# EasyEDA schematic schematic.json
TITLE: LED Chaser with 555 IC and CD4017; REV: 2.0; Date: 2025-02-25; Sheet: 1/1; Drawn By: Angelina Tsuboi; Company: Angelina Tsuboi and John Cohn
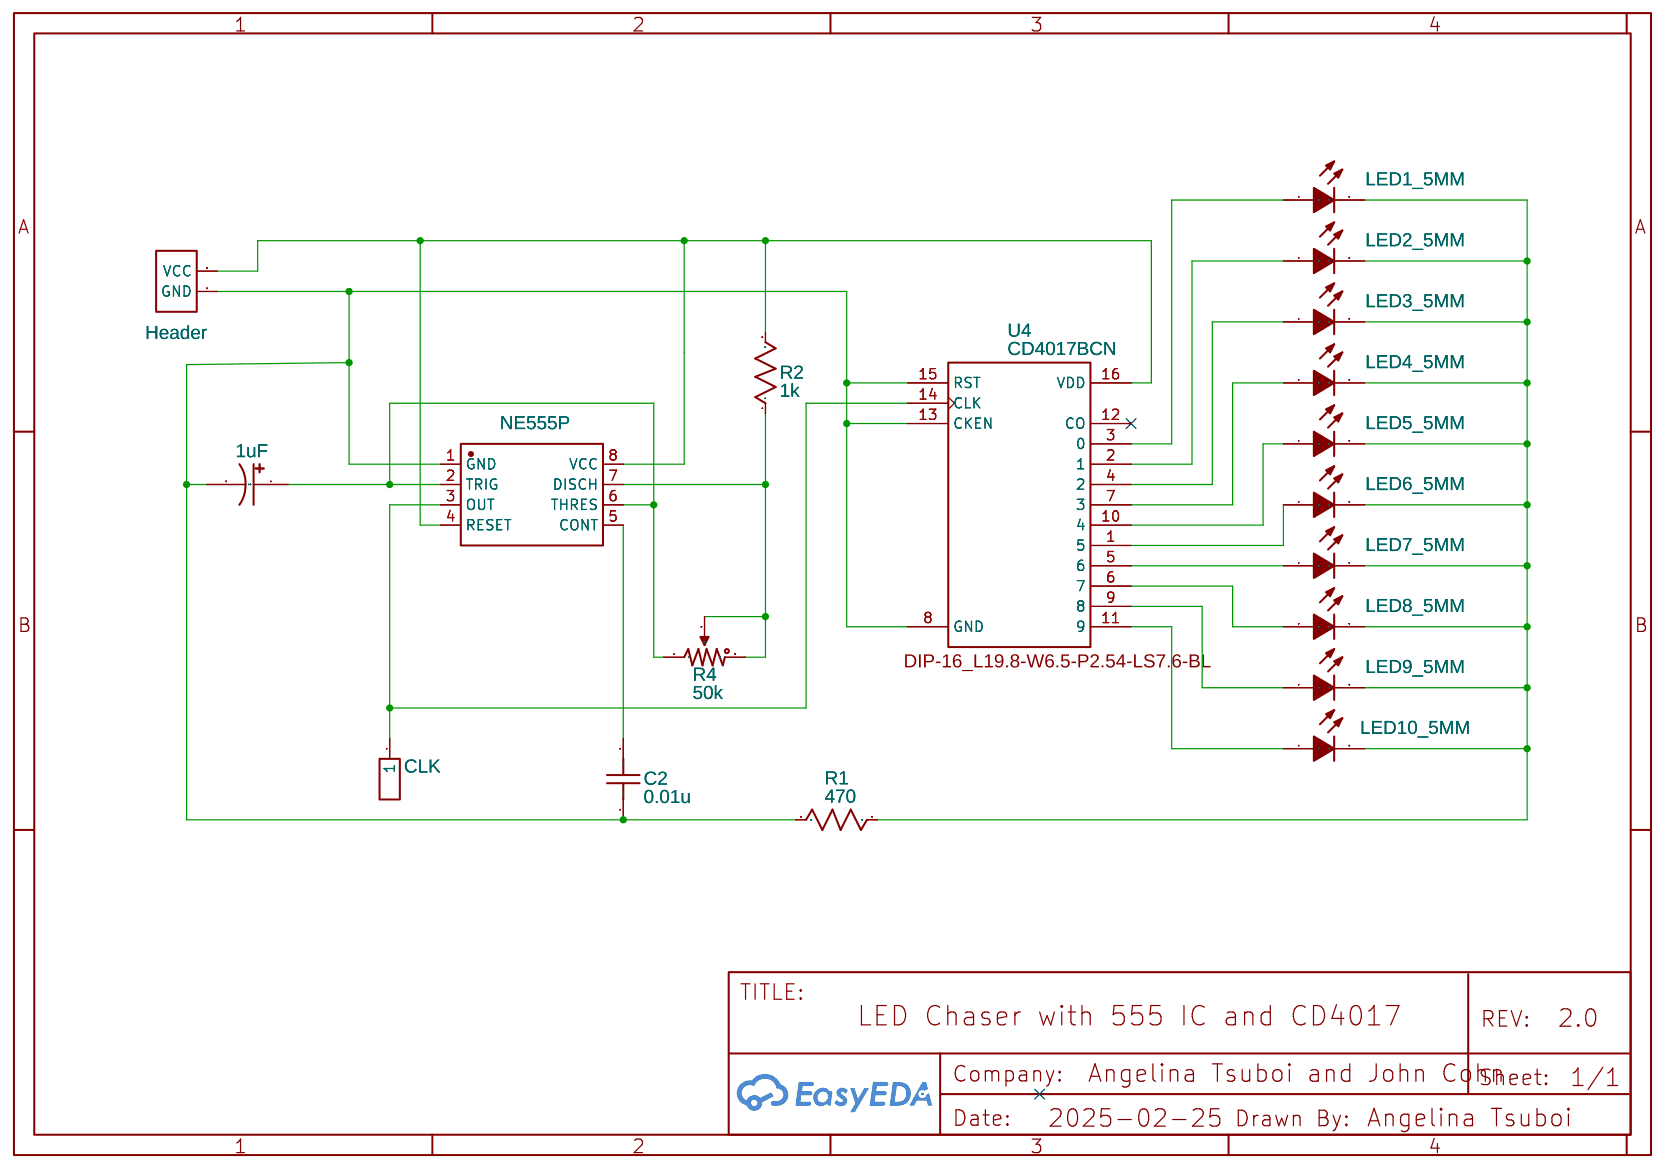
[diagram p0: schematic sheet]

## Parts
C1  1uF  [CAP-TH_BD5.0-P2.00-D0.8-FD]
C2  0.01u  [C0603]
CLK  C81276  [HDR-TH_1P-P2.54-V-M]
H1  Header  [HDR-M-2.54_1X2]
LED1_5MM  LED_5MM  [LED-TH_BD5.0-P2.54-FD_C9900023552]
LED2_5MM  LED_5MM  [LED-TH_BD5.0-P2.54-FD_C9900023552]
LED3_5MM  LED_5MM  [LED-TH_BD5.0-P2.54-FD_C9900023552]
LED4_5MM  LED_5MM  [LED-TH_BD5.0-P2.54-FD_C9900023552]
LED5_5MM  LED_5MM  [LED-TH_BD5.0-P2.54-FD_C9900023552]
LED6_5MM  LED_5MM  [LED-TH_BD5.0-P2.54-FD_C9900023552]
LED7_5MM  LED_5MM  [LED-TH_BD5.0-P2.54-FD_C9900023552]
LED8_5MM  LED_5MM  [LED-TH_BD5.0-P2.54-FD_C9900023552]
LED9_5MM  LED_5MM  [LED-TH_BD5.0-P2.54-FD_C9900023552]
LED10_5MM  LED_5MM  [LED-TH_BD5.0-P2.54-FD_C9900023552]
R1  470  [R_AXIAL-0.3]
R2  1k  [R_AXIAL-0.3]
R4  50k  [RES-ADJ-3296X]
U2  NE555P  [DIP-8_L9.8-W6.6-P2.54-LS7.6-BL]
U4  CD4017BCN  [DIP-16_L19.8-W6.5-P2.54-LS7.6-BL]

## Library data of the parts
C1 = UVZ1H010MDD: Contributor: LCSC; Supplier: LCSC; Supplier Part: C62934; Manufacturer: Nichicon(尼吉康)
C2 = C_0603_US: Supplier Part: C5121924; Supplier: LCSC; Contributor: LCEDA_Lib
CLK = Header-Male-2.54_1x1: Supplier: LCSC; Manufacturer Part: 2.54-1*1P针; JLCPCB Part Class: Extended Part; Package Display: No; Manufacturer: BOOMELE(Boom Precision Elec); Contributor: Thejo Prakash
H1 = HEADER-FEMALE-2.54_1X2: Contributor: nonstop2004; Supplier: LCSC; Supplier Part: C492401; Package Display: No
LED1_5MM LED2_5MM LED3_5MM LED4_5MM LED5_5MM LED6_5MM LED7_5MM LED8_5MM LED9_5MM LED10_5MM = LED_5MM: Contributor: lcsc; Supplier: LCSC; Supplier Part: C2895480
R1 = Resistor: Manufacturer Part: ?; Supplier Part: C58592; Supplier: LCSC
R2 = Resistor: Manufacturer Part: ?; Supplier Part: C713997; Supplier: LCSC
R4 = Potentiometer: K(%): 50; Manufacturer Part: ?; Supplier: LCSC; Supplier Part: C118912
U2 = NE555P: Supplier: LCSC; Manufacturer: TI(德州仪器); Supplier Part: C46749; JLCPCB Part Class: Extended Part
U4 = CD4017BCN: Decade CounterDivider with 10 Decoded Outputs; Supplier: LCSC; Supplier Part: C32710674; Package Display: Yes

## Nets
Net-(C1-1): C1.1 R4.1 U2.2(TRIG) U2.6(THRES)
Net-(C1-2): C1.2 C2.2 H1.2(GND) R1.2 U2.1(GND) U4.8(GND) U4.13(CKEN) U4.15(RST)
Net-(C2-1): C2.1 U2.5(CONT)
Net-(CLK-1): CLK.1 U2.3(OUT) U4.14(CLK)
Net-(H1-1): H1.1(VCC) R2.2 U2.4(RESET) U2.8(VCC) U4.16(VDD)
Net-(LED1_5MM-1): LED1_5MM.1(A) U4.3(0)
Net-(LED1_5MM-2): LED1_5MM.2(K) LED2_5MM.2(K) LED3_5MM.2(K) LED4_5MM.2(K) LED5_5MM.2(K) LED6_5MM.2(K) LED7_5MM.2(K) LED8_5MM.2(K) LED9_5MM.2(K) LED10_5MM.2(K) R1.1
Net-(LED2_5MM-1): LED2_5MM.1(A) U4.2(1)
Net-(LED3_5MM-1): LED3_5MM.1(A) U4.4(2)
Net-(LED4_5MM-1): LED4_5MM.1(A) U4.7(3)
Net-(LED5_5MM-1): LED5_5MM.1(A) U4.10(4)
Net-(LED6_5MM-1): LED6_5MM.1(A) U4.1(5)
Net-(LED7_5MM-1): LED7_5MM.1(A) U4.5(6)
Net-(LED8_5MM-1): LED8_5MM.1(A) U4.6(7)
Net-(LED9_5MM-1): LED9_5MM.1(A) U4.9(8)
Net-(LED10_5MM-1): LED10_5MM.1(A) U4.11(9)
Net-(R2-1): R2.1 R4.2(3) R4.3(2) U2.7(DISCH)

Not connected (* = marked no-connect by the designer): U4 12(CO)*
